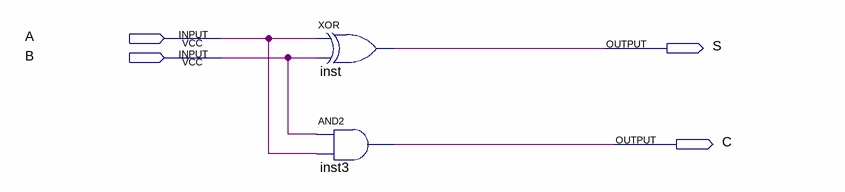
[diagram p0: schematic sheet]
// Quartus schematic halfadd.bdf as structural Verilog: 2 symbols, 4 pins
module halfadd (
  input  A,
  input  B,
  output S,
  output C
);

  xor inst (S, A, B);
  and inst3 (C, B, A);
endmodule
